# EAGLE design Delay_circuit_555 (EAGLE 6.1)
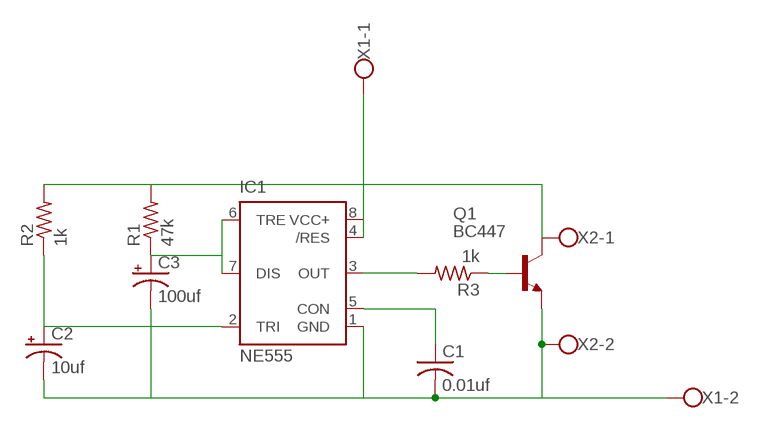
[diagram p0: schematic, sheet 1]

## Parts
C1  0.01uf  C-US025-025X050  [C025-025X050]
C2  10uf  CPOL-USE2.5-6  [E2,5-6]
C3  100uf  CPOL-USE2.5-6  [E2,5-6]
IC1  NE555  [DIL-08]
Q1  BC447  [TO92-EBC]
R1  47k  R-US_0207/10  [0207/10]
R2  1k  R-US_0207/10  [0207/10]
R3  1k  R-US_0207/10  [0207/10]
X1  W237-102  [W237-102]
X2  W237-102  [W237-102]

## Nets
N$1: IC1.4(/RES) IC1.8(VCC+) Q1.C R1.2 R2.2 X1.1 X2.1
N$2: C3.+ IC1.6(TRE) IC1.7(DIS) R1.1
N$4: C1.2 C2.- C3.- IC1.1(GND) Q1.E X1.2 X2.2
N$5: C2.+ IC1.2(TRI) R2.1
N$7: C1.1 IC1.5(CON)
N$8: IC1.3(OUT) R3.2
N$9: Q1.B R3.1

## Library data of the parts
C1 = rcl:C-US: CAPACITOR, American symbol
C2 C3 = rcl:CPOL-US: POLARIZED CAPACITOR, American symbol
IC1 = st-microelectronics:NE555: General purpose bipolar Timer; MF: Arrow Electronics; MPN: NE555N; OC_FARNELL: 1467742; OC_NEWARK: 89K1486
Q1 = transistor-npn:BC447*: NPN Transistor
R1-R3 = rcl:R-US_: RESISTOR, American symbol
X1 X2 = con-wago-500:W237-102: WAGO SCREW CLAMP; MPN: 237-102; OC_FARNELL: unknown; OC_NEWARK: 70K9898

## Board
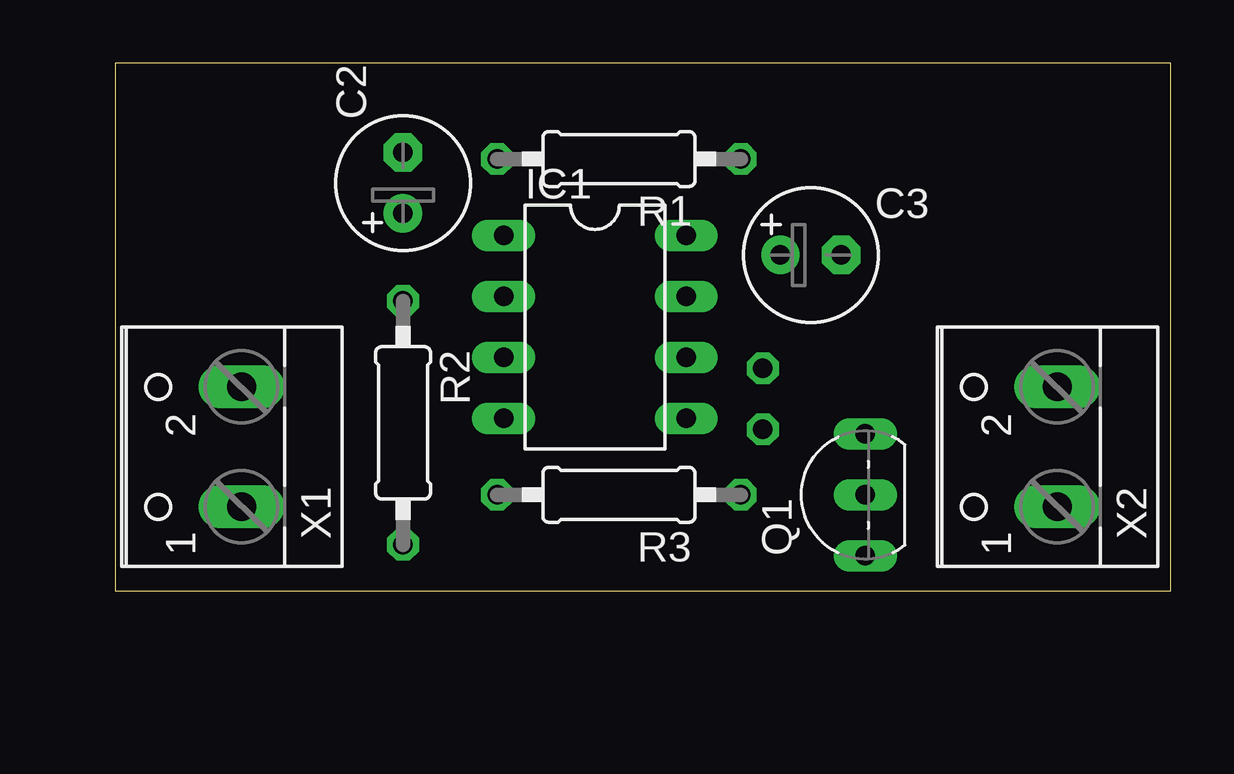
[diagram p1: board, top side]
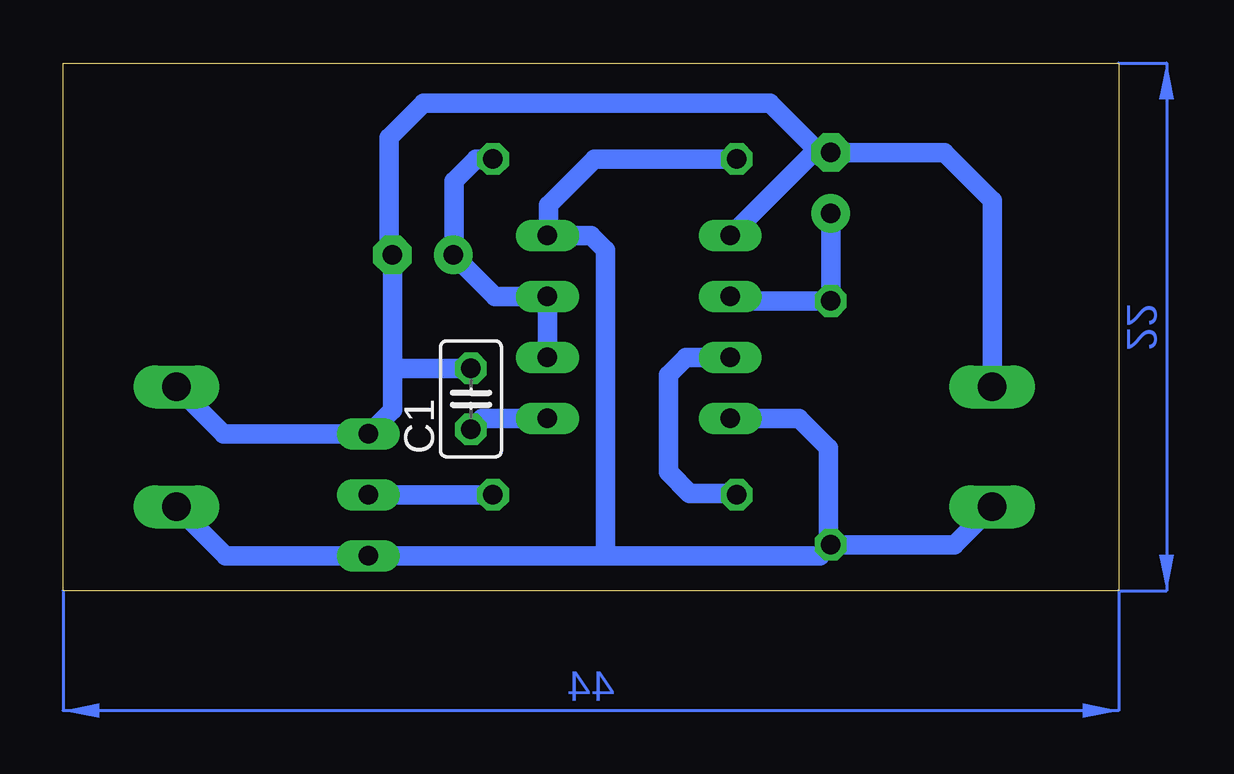
[diagram p2: board, bottom side, seen from below]

Size 44 x 22 mm. Coordinates in mm from the lower left corner, seen from the top.
Outline: 0,0 44,0 44,22 0,22 0,0
Copper layers (1*16): Top 0.035mm / dielectric 1.5mm / Bottom 0.035mm
Design rules: minimum track width 10mil, minimum drill 24mil, track to track 8mil, track to pad 8mil, pad to pad 8mil, via to via 8mil, smd to smd 8mil, copper to edge 40mil, drill to drill 8mil, minimum pad ring 10mil, minimum via ring 8mil, stop-mask expansion 4mil, vias tented up to drill 0mil, thermal gap 10mil

### Footprints (pad centres in the part's own frame; a part is rotated, then mirrored left to right if it is on the bottom)
C025-025X050 = drill 0.813 octagon: 1 -1.27,0; 2 1.27,0
E2,5-6 = drill 0.813 pad 1.6: + -1.27,0 | drill 0.813 pad 1.6 octagon: - 1.27,0
DIL-08 = drill 0.813 long: 1 -3.81,-3.81; 2 -1.27,-3.81; 3 1.27,-3.81; 4 3.81,-3.81; 5 3.81,3.81; 6 1.27,3.81; 7 -1.27,3.81; 8 -3.81,3.81
TO92-EBC = drill 0.813 long: B 0,-1.27; C -2.54,-1.27; E 2.54,-1.27
0207/10 = drill 0.813 octagon: 1 -5.08,0; 2 5.08,0
W237-102 = drill 1.194 long: 1 -2.5,-1.27; 2 2.5,-1.27

### Placement (x,y rotation side)
C1  27,8 90 bottom
C2  12,17 90 top
C3  29,14 0 top
IC1  20,11 270 top
Q1  30,4 90 top
R1  21,18 180 top
R2  12,7 270 top
R3  21,4 180 top
X1  4,6 90 top
X2  38,6 90 top

### Tracks (layer width: path | path; a pad name or v marks a point on that pad's centre or on a via)
N$1
  Bottom 0.813: R2.2 6.85,1.92 X1.1 | 21.26,1.46 Q1.C 37.23,1.46 X2.1 | 21.26,1.46 12.46,1.46 R2.2 | 21.26,1.46 21.39,1.59 21.39,14.2 22,14.81 IC1.8 23.77,14.85 23.77,16.08 21.85,18 R1.2 | IC1.4 13.34,7.19 12.09,5.94 12.09,2.01 R2.2
N$2
  Bottom 0.813: IC1.6 IC1.7 26,12.27 C3.+ 27.71,14.02 27.71,17.07 26.78,18 R1.1
N$4
  Bottom 0.813: X1.2 5.27,16.27 7.26,18.26 C2.- 12.48,18.27 | 30.27,9.2 C3.- 30.29,14.02 30.4,14.02 | 30.27,9.2 30.27,7.54 Q1.E 37.31,6.54 X2.2 | C1.2 30.2,9.27 30.27,9.2 | 12.48,18.27 14.53,20.32 28.98,20.32 30.4,18.9 30.4,14.02 | 30.4,14.02 30.48,13.95 | 12.48,18.27 12.73,18.27 IC1.1
N$5
  Bottom 0.813: IC1.2 16,12.08 R2.1 C2.+
N$7
  Bottom 0.813: IC1.5 26.54,7.19 C1.1
N$8
  Bottom 0.813: IC1.3 18.03,9.73 18.77,8.99 18.77,4.95 17.88,4.06 15.98,4.06 R3.2
N$9
  Bottom 0.813: R3.1 Q1.B
(copper drawn outside any net)
  shapes: Bottom area x2